# EAGLE design Environment-ArduinoNano33-V10.1-Top (EAGLE 7.4.0)
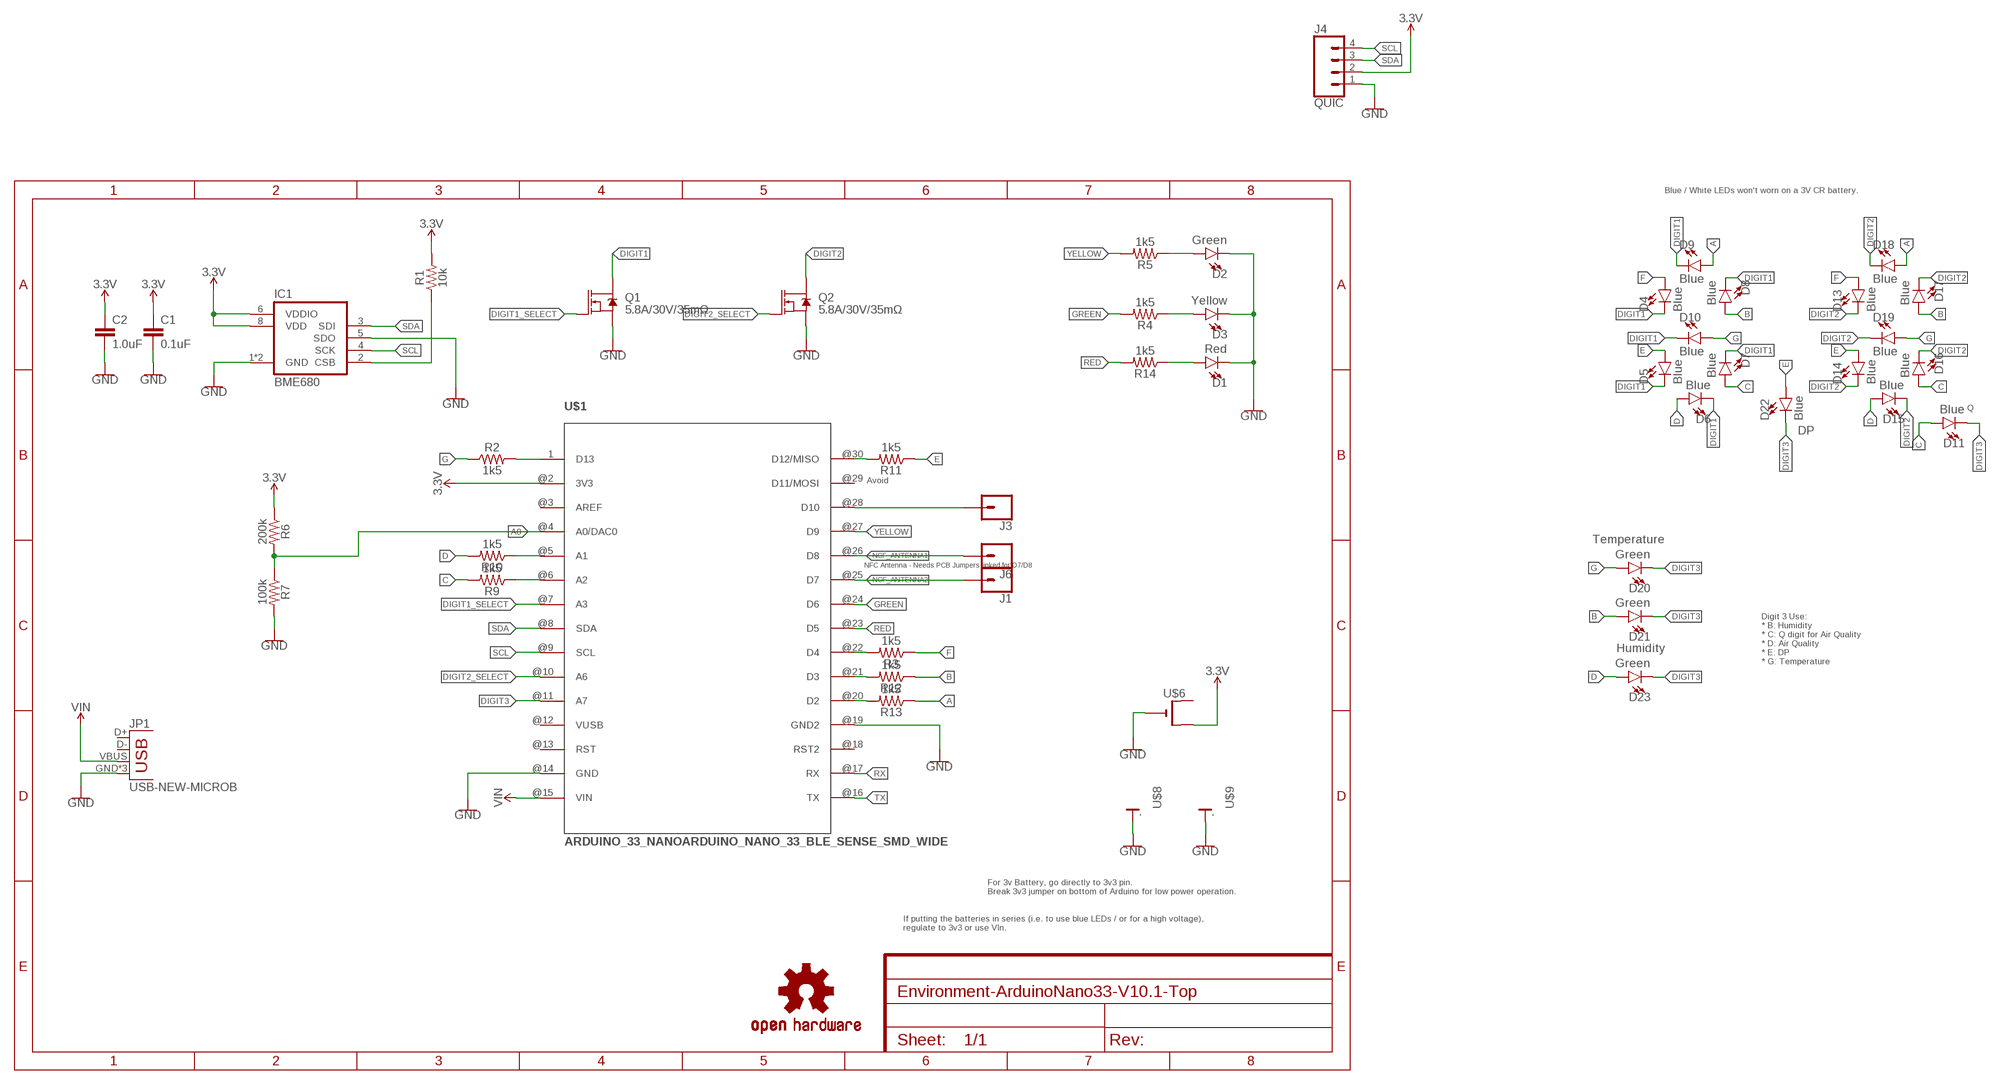
[diagram p0: schematic, sheet 1]

## Parts
C1  0.1uF  0.1UF-0805-25V  [0805]
C2  1.0uF  1.0UF-0805-25V-10%  [0805]
D1  Red  LED1206  [LED-1206]
D2  Green  LED1206  [LED-1206]
D3  Yellow  LED1206  [LED-1206]
D4  Blue  LED1206  [LED-1206]
D5  Blue  LED1206  [LED-1206]
D6  Blue  LED1206  [LED-1206]
D7  Blue  LED1206  [LED-1206]
D8  Blue  LED1206  [LED-1206]
D9  Blue  LED1206  [LED-1206]
D10  Blue  LED1206  [LED-1206]
D11  Blue  LED1206  [LED-1206]
D13  Blue  LED1206  [LED-1206]
D14  Blue  LED1206  [LED-1206]
D15  Blue  LED1206  [LED-1206]
D16  Blue  LED1206  [LED-1206]
D17  Blue  LED1206  [LED-1206]
D18  Blue  LED1206  [LED-1206]
D19  Blue  LED1206  [LED-1206]
D20  Green  LED1206  [LED-1206]
D21  Green  LED1206  [LED-1206]
D22  Blue  LED1206  [LED-1206]
D23  Green  LED1206  [LED-1206]
IC1  BME680  [BME680]
J1  CONN_01  [1X01]
J3  CONN_01  [1X01]
J4  QUIC  CONN_04SMD2  [JST04_1MM_RA]
J6  CONN_01  [1X01]
JP1  USB-NEW-MICROB  [USB-MICROB]
LOGO1  OSHW-LOGOM  [OSHW-LOGO-M]
Q1  5.8A/30V/35mΩ  MOSFET-NCH-AO3404A  [SOT23-3]
Q2  5.8A/30V/35mΩ  MOSFET-NCH-AO3404A  [SOT23-3]
R1  10k  RESISTOR0805  [0805]
R2  1k5  RESISTOR0805  [0805]
R3  1k5  RESISTOR0805  [0805]
R4  1k5  RESISTOR0805  [0805]
R5  1k5  RESISTOR0805  [0805]
R6  200k  RESISTOR0805  [0805]
R7  100k  RESISTOR0805  [0805]
R9  1k5  RESISTOR0805  [0805]
R10  1k5  RESISTOR0805  [0805]
R11  1k5  RESISTOR0805  [0805]
R12  1k5  RESISTOR0805  [0805]
R13  1k5  RESISTOR0805  [0805]
R14  1k5  RESISTOR0805  [0805]
U$1  ARDUINO_33_NANOARDUINO_NANO_33_BLE_SENSE_SMD_WIDE  [ARDUINO_NANO_33_SMD_WIDER_PADS]
U$6  CR2032SMT  [CR2032-SMD]
U$8  CR2032-SPLIT-PCBCR2032-NEGATIVE  [CR2032-SMD-NEGATIVE-TERMINAL]
U$9  CR2032-SPLIT-PCBCR2032-NEGATIVE  [CR2032-SMD-NEGATIVE-TERMINAL]

## Nets
3.3V: C1.1 C2.1 IC1.6(VDDIO) IC1.8(VDD) J4.2 R1.2 R6.1 U$1.@2(3V3) U$6.+$2(+1)
A: D9.A D18.A R13.1
A0: R6.2 R7.1 U$1.@4(A0/DAC0)
B: D8.A D17.A D21.A R12.1
C: D7.A D11.A D16.A R9.2
D: D6.A D15.A D23.A R10.2
DIGIT1: D4.C D5.C D6.C D7.C D8.C D9.C D10.C Q1.3(D)
DIGIT1_SELECT: Q1.1(G) U$1.@7(A3)
DIGIT2: D13.C D14.C D15.C D16.C D17.C D18.C D19.C Q2.3(D)
DIGIT2_SELECT: Q2.1(G) U$1.@10(A6)
DIGIT3: D11.C D20.C D21.C D22.C D23.C U$1.@11(A7)
E: D5.A D14.A D22.A R11.1
F: D4.A D13.A R3.1
G: D10.A D19.A D20.A R2.1
GND: C1.2 C2.2 D1.C D2.C D3.C IC1.1(GND) IC1.5(SDO) IC1.7(GND) J4.1 JP1.GND JP1.MT1(GND) JP1.MT2(GND) Q1.2(S) Q2.2(S) R7.2 U$1.@14(GND) U$1.@19(GND2) U$6.- U$8.- U$9.-
GREEN: R4.2 U$1.@24(D6)
N$2: IC1.2(CSB) R1.1
N$4: D1.A R14.1
N$7: R9.1 U$1.@6(A2)
N$8: R2.2 U$1.1(D13)
N$9: R11.2 U$1.@30(D12/MISO)
N$10: R12.2 U$1.@21(D3)
N$11: R10.1 U$1.@5(A1)
N$12: R13.2 U$1.@20(D2)
N$13: R3.2 U$1.@22(D4)
N$14: D3.A R4.1
N$16: D2.A R5.1
N$43: J3.1 U$1.@28(D10)
NCF_ANTENNA1: J6.1 U$1.@26(D8)
NCF_ANTENNA2: J1.1 U$1.@25(D7)
RED: R14.2 U$1.@23(D5)
RX: U$1.@17(RX)
SCL: IC1.4(SCK) J4.4 U$1.@9(SCL)
SDA: IC1.3(SDI) J4.3 U$1.@8(SDA)
TX: U$1.@16(TX)
VIN: JP1.VBUS U$1.@15(VIN)
YELLOW: R5.2 U$1.@27(D9)
Unconnected: JP1.D+ JP1.D- U$1.@3(AREF) U$1.@13(RST) U$1.@18(RST2) U$1.@29(D11/MOSI) U$6.+$1(+)

## Notes on the sheet
- Blue / White LEDs won't worn on a 3V CR battery.
- Q
- DP
- Avoid
- Temperature
- NFC Antenna - Needs PCB Jumpers linked for D7/D8
- Humidity
- Digit 3 Use:
  * B: Humidity
  * C: Q digit for Air Quality
  * D: Air Quality
  * E: DP
  * G: Temperature
- For 3v Battery, go directly to 3v3 pin.
  Break 3v3 jumper on bottom of Arduino for low power operation.
- If putting the batteries in series (i.e. to use blue LEDs / or for a high voltage), 
  regulate to 3v3 or use VIn.

## Power pins joined to a net without a drawn wire
VUSB: U$1.@12(VUSB)

## Library data of the parts
C1 = ThingySticks:0.1UF: 0.1µF ceramic capacitors A capacitor is a passive two-terminal electrical component used to store electrical energy temporarily in an electric field.
C2 = ThingySticks:1.0UF: 1µF ceramic capacitors A capacitor is a passive two-terminal electrical component used to store electrical energy temporarily in an electric field.
D1-D11 D13-D23 = ThingySticks:LED: LED (Generic) Standard schematic elements and footprints for 5mm, 3mm, 1206, and 0603 sized LEDs. Generic LEDs with no color specified.
IC1 = ThingySticks:BME680: BME680 integrates for the first time individual high linearity and high accuracy sensors for gas, pressure, humidity and temperature. The library has been designed by Richard Magdycz <https://www.facebook.com/groups/eaglecadsoftUK> Original version had pins in incorrect places (BME680 uses untypical clockwise direction). Updated 17 Feb 2018 S.Harrison ThingySticks.com
J1 J3 J6 = SparkFun-Connectors:CONN_01: Single connection point. Often used as Generic Header-pin footprint for 0.1 inch spaced/style header connections On any of the 0.1 inch spaced packages, you can populate with these: Break Away Headers - Straight <https://www.sparkfun.com/products/116> (PRT-00116) Break Away Male Headers - Right Angle <https://www.sparkfun.com/products/553> (PRT-00553) Female Headers <https://www.sparkfun.com/products/115> (PRT-00115) Break Away Headers - Machine Pin <https://www.sparkfun.com/products/117> (PRT-00117) Break Away Female Headers - Swiss Machine Pin <https://www.sparkfun.com/products/743> (PRT-00743) This device is also useful as a general connection point to wire up your design to another part of your project. Our various solder wires solder well into these plated through hole pads. Hook-Up Wire - Assortment (Stranded, 22 AWG) <https://www.sparkfun.com/products/11375> (PRT-11375) Hook-Up Wire - Assortment (Solid Core, 22 AWG) <https://www.sparkfun.com/products/11367> (PRT-11367) View the entire wire category on our website here <https://www.sparkfun.com/categories/141> Special notes: SMTSO-256-ET is a "flush mount" nut for a 4-40 screw. We mostly use this on specialty testbeds; it is a nice way to connect hardware to your PCB at an adjustable hieght. Also note, the SNAP packages are for using a snappable style connector. We sell a baggie of snaps and they are also used on two LilyPad designs: Snap Assortment - 30 pack (male and female) <https://www.sparkfun.com/products/11347> (DEV-11347) LilyPad Arduino SimpleSnap <https://www.sparkfun.com/products/10941> (DEV-10941) LilyPad SimpleSnap Protoboard <https://www.sparkfun.com/products/10940> (DEV-10940)
J4 = SparkFun-Connectors-2020-01-17:CONN_04: Multi connection point. Often used as Generic Header-pin footprint for 0.1 inch spaced/style header connections On any of the 0.1 inch spaced packages, you can populate with these: Break Away Headers - Straight <https://www.sparkfun.com/products/116> (PRT-00116) Break Away Male Headers - Right Angle <https://www.sparkfun.com/products/553> (PRT-00553) Female Headers <https://www.sparkfun.com/products/115> (PRT-00115) Break Away Headers - Machine Pin <https://www.sparkfun.com/products/117> (PRT-00117) Break Away Female Headers - Swiss Machine Pin <https://www.sparkfun.com/products/743> (PRT-00743) For SCREWTERMINALS and SPRING TERMINALS visit here: Screw Terimnals on SparkFun.com <https://www.sparkfun.com/search/results?term=Screw+Terminals> (5mm/3.5mm/2.54mm spacing) This device is also useful as a general connection point to wire up your design to another part of your project. Our various solder wires solder well into these plated through hole pads. Hook-Up Wire - Assortment (Stranded, 22 AWG) <https://www.sparkfun.com/products/11375> (PRT-11375) Hook-Up Wire - Assortment (Solid Core, 22 AWG) <https://www.sparkfun.com/products/11367> (PRT-11367) View the entire wire category on our website here <https://www.sparkfun.com/categories/141> Special notes: Molex polarized connector foot print use with SKU : PRT-08231 with associated crimp pins and housings. 1MM SMD Version SKU: PRT-10208; PROD_ID: CONN-10310; SF_ID: PRT-10208
JP1 = Tinamous:USB-NEW: USB Connectors USB-B-PTH is fully proven SKU : PRT-00139/CONN-08278 USB-miniB is fully proven SKU : PRT-00587 USB-A-PCB is untested. USB-A-H is throughly reviewed, but untested. Spark Fun Electronics SKU : PRT-00437 USB-B-SMT is throughly reviewed, but untested. Needs silkscreen touching up. USB-A-S has not been used/tested USB-MB-H has not been used/tested USB-MICROB has been used. CONN-09505; PROD_ID: CONN-09505
LOGO1 = SparkFun-Aesthetics:OSHW-LOGO: Open-Source Hardware (OSHW) Logo This logo indicates the piece of hardware it is found on incorporates a OSHW license and/or adheres to the definition of open source hardware found here: http://freedomdefined.org/OSHW
Q1 Q2 = SparkFun-DiscreteSemi:MOSFET-NCH: N-channel MOSFETs Voltage controlled devices that allow control of high current outputs. SparkFun Products: SparkFun OpenScale <https://www.sparkfun.com/products/13261> SparkFun Digital Sandbox <https://www.sparkfun.com/products/12651> SparkFun Monster Moto Shield <https://www.sparkfun.com/products/10182> SparkFun MOSFET Power Controller <https://www.sparkfun.com/products/11214>; PROD_ID: TRANS-12988
R1-R7 R9-R14 = SparkFun-Resistors:RESISTOR: Generic Resistor Package
U$1 = ThingySticks:ARDUINO_33_NANO: https://store.arduino.cc/nano-33-iot
U$6 = ThingySticks:CR2032
U$8 U$9 = ThingySticks:CR2032-SPLIT-PCB

## Board
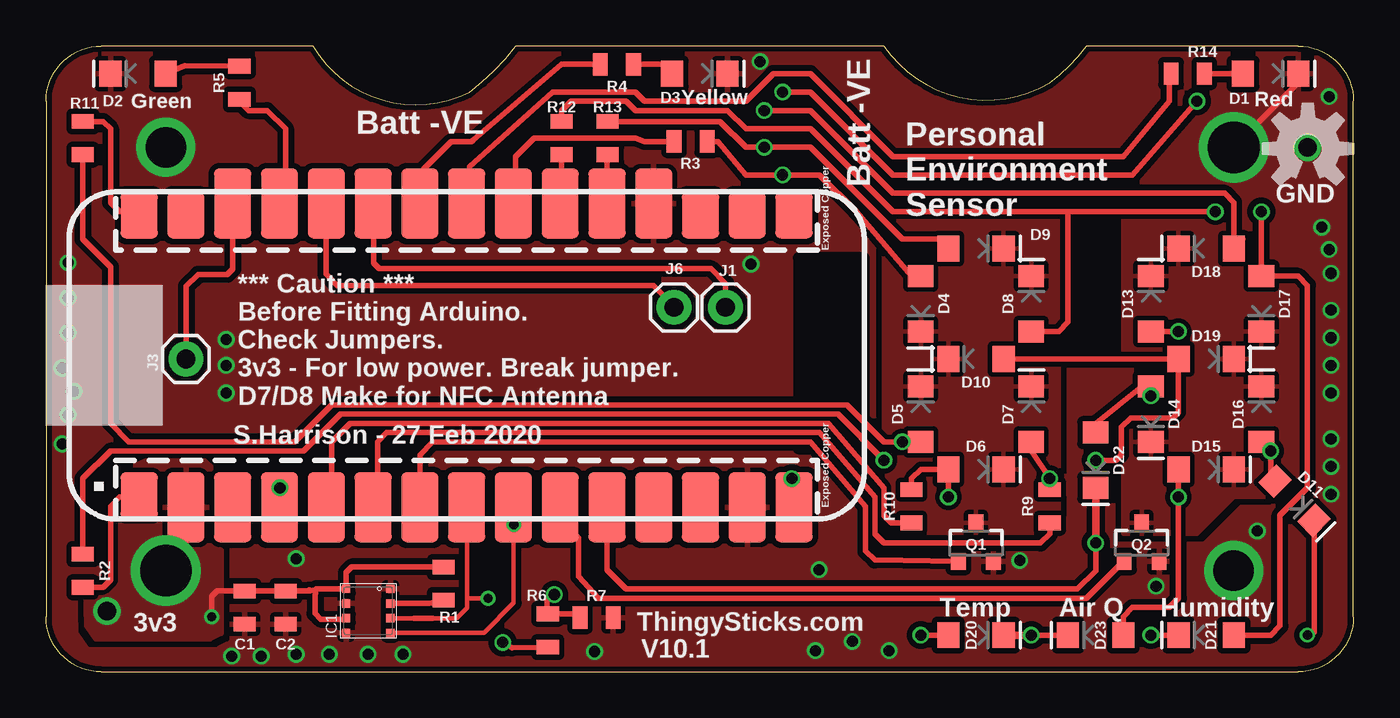
[diagram p1: board, top side]
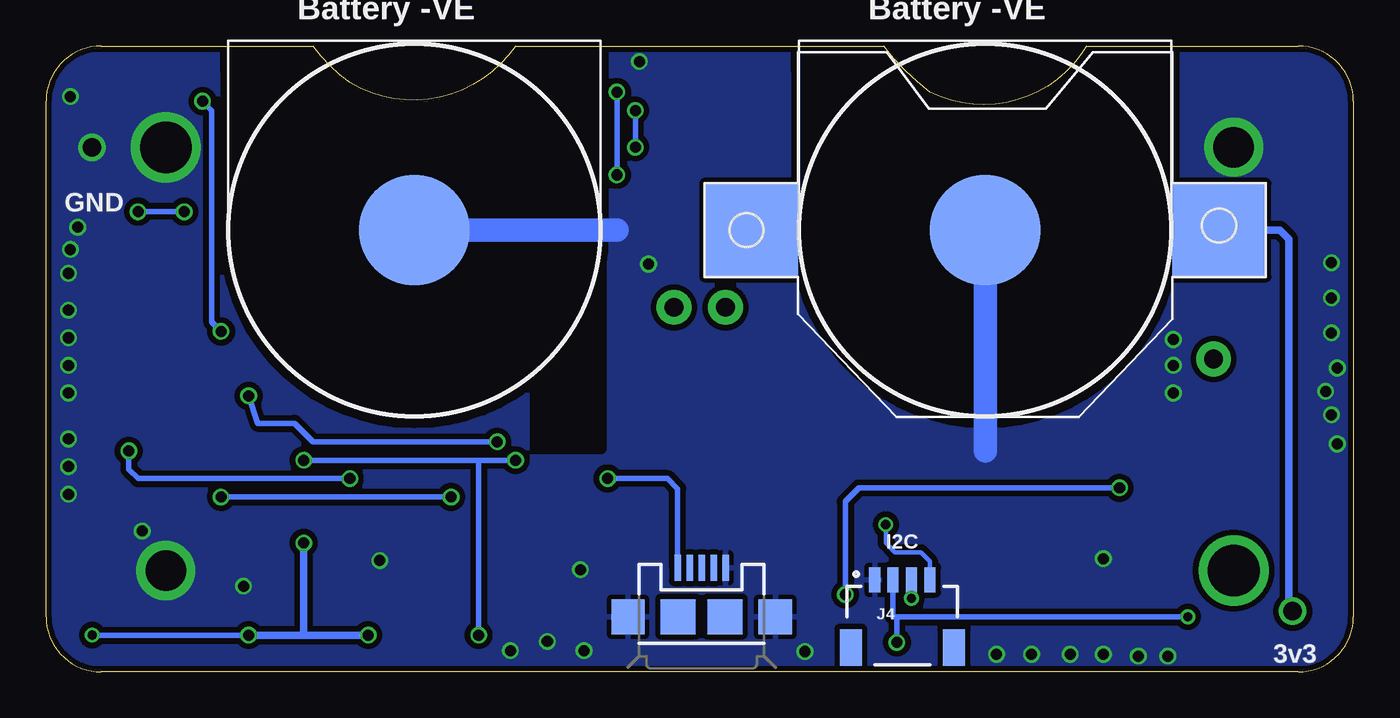
[diagram p2: board, bottom side, seen from below]

Size 71 x 34 mm. Coordinates in mm from the lower left corner, seen from the top.
Outline: 3,0 68,0 arc90 71,3 71,31 arc90 68,34 56.5,34 arc-16 54.5,32 arc-86 45.5,34 25.5,34 arc-16 23,31.5 arc-86 14.5,34 3,34 arc90 0,31 0,3 arc90 3,0
Copper layers (1*16): Top 0.035mm / dielectric 1.5mm / Bottom 0.035mm
Design rules "dirt_cheap_dirty_boards.v1.1": minimum track width 6mil, minimum drill 12mil, track to track 6mil, track to pad 6mil, pad to pad 6mil, via to via 6mil, smd to smd 0mil, copper to edge 10mil, drill to drill 10mil, minimum pad ring 10mil, minimum via ring 6mil, stop-mask expansion 2mil, vias tented up to drill 25mil, thermal gap 10mil
tKeepout: area 4.5,26.5 to 8.5,30.5; area 4.3,3.3 to 8.7,7.7; area 62.3,3.3 to 66.7,7.7; area 62.3,26.3 to 66.7,30.7
bKeepout: area 62.5,26.5 to 66.5,30.5; area 62.5,3.5 to 66.5,7.5; area 4.3,26.3 to 8.7,30.7; area 4.5,3.5 to 8.5,7.5; area 0,0 to 71,34
bRestrict: area 10,14 to 30,34; area 41,14 to 61,34

### Footprints (pad centres in the part's own frame; a part is rotated, then mirrored left to right if it is on the bottom)
0805 = smd 0.8 x 1.2: 1 -0.9,0; 2 0.9,0
LED-1206 = smd 1.2 x 1.4: A -1.5,0; C 1.5,0
BME680 = smd 0.45 x 0.45: 1 1.2,-1.2; 2 0.4,-1.2; 3 -0.4,-1.2; 4 -1.2,-1.2; 5 -1.2,1.2; 6 -0.4,1.2; 7 0.4,1.2; 8 1.2,1.2
1X01 = drill 1.016 pad 1.88: 1 0,0
JST04_1MM_RA = smd 0.6 x 1.35: 1 -1.5,0; 2 -0.5,0; 3 0.5,0; 4 1.5,0 | smd 1.2 x 2: NC1 2.8,-3.675; NC2 -2.8,-3.675
USB-MICROB = smd 0.35 x 1.4: D+ 0,2.65; D- -0.65,2.65; GND 1.3,2.65; ID 0.65,2.65; VBUS -1.3,2.65 | smd 1.8 x 1.9: MT1 -4,0; MT2 4,0 | smd 1.9 x 1.9: P$1 -1.27,0; P$2 1.27,0
SOT23-3 = smd 0.8 x 0.9: 1 -0.95,-1; 2 0.95,-1; 3 0,1.1
ARDUINO_NANO_33_SMD_WIDER_PADS = smd 2.54 x 2.032: 1 1.27,-3.81; @16 16.51,-39.37; @17 16.51,-36.83; @18 16.51,-34.29; @29 16.51,-6.35; @30 16.51,-3.81 | smd 3.81 x 2.032: @2 0.635,-6.35; @3 0.635,-8.89; @4 0.635,-11.43; @5 0.635,-13.97; @6 0.635,-16.51; @7 0.635,-19.05; @8 0.635,-21.59; @9 0.635,-24.13; @10 0.635,-26.67; @11 0.635,-29.21; @12 0.635,-31.75; @13 0.635,-34.29; @14 0.635,-36.83; @15 0.635,-39.37; @19 17.145,-31.75; @20 17.145,-29.21; @21 17.145,-26.67; @22 17.145,-24.13; @23 17.145,-21.59; @24 17.145,-19.05; @25 17.145,-16.51; @26 17.145,-13.97; @27 17.145,-11.43; @28 17.145,-8.89
CR2032-SMD = smd 5.08 x 5.08: +$1 -12.7,0; +$2 12.7,0 | smd 4.064 x 4.064: - 0,0
CR2032-SMD-NEGATIVE-TERMINAL = smd 6 x 6: - 0,0

### Placement (x,y rotation side)
C1  10.79,3.49 270 top
C2  13.02,3.49 270 top
D1  66.5,32.5 0 top
D2  5,32.5 180 top
D3  35.5,32.5 0 top
D4  47.5,20 270 top
D5  47.5,14 90 top
D6  50.5,11 0 top
D7  53.5,14 90 top
D8  53.5,20 90 top
D9  50.5,23 0 top
D10  50.5,17 180 top
D11  67.8,9.3 315 top
D13  60,20 90 top
D14  60,14 270 top
D15  63,11 0 top
D16  66,14 90 top
D17  66,20 270 top
D18  63,23 180 top
D19  63,17 0 top
D20  50.5,2 0 top
D21  63,2 180 top
D22  57,11.5 270 top
D23  57,2 180 top
IC1  17.5,3.32 90 top
J1  36.9,19.8 270 top
J3  7.6,17 0 top
J4  24.5,5 0 bottom
J6  34.1,19.8 270 top
JP1  35.4,3 0 bottom
LOGO1  68.53,28.42 0 top
Q1  50.5,7 0 top
Q2  59.5,7 0 top
R1  21.59,4.8 90 top
R2  2,5.5 270 top
R3  35,28.82 180 top
R4  31,33 180 top
R5  10.5,32 270 top
R6  27.25,2.25 90 top
R7  29.9,2.95 0 top
R9  54.5,9 90 top
R10  47,9 90 top
R11  2,29 90 top
R12  28,29 270 top
R13  30.5,29 270 top
R14  62,32.5 180 top
U$1  1.25,8.3 90 top
U$6  20,24 0 bottom
U$8  20,24 0 bottom
U$9  51,24 0 bottom

### Tracks (layer width: path | path; a pad name or v marks a point on that pad's centre or on a via)
3.3V  (via drill 0.5, 0.6, 1, 2.8)
  Top 0.305: 14.85,4.52 14.68,4.52 14.61,4.13 14.61,3.17 14.92,2.86 16.24,2.86 IC1.6 | 14.34,4.39 14.29,4.45 | 7.94,7.94 7.62,8.26 7.62,9.55 U$1.@2 | C2.1 C1.1 9.29,4.39 9,4.1 v9,3 | C2.1 14.34,4.39 | 14.34,4.39 14.85,4.52 | 14.85,4.52 IC1.8 16.3,5.4 16.6,5.7 R1.2 | 13,4.41 C2.1 | R6.1 26.95,1.35 25.3,1.3 v24.8,1.6
  Bottom 0.305: J4.2 25,3 24.8,3 | 24.8,3 v9,3 | v24.8,1.6 24.8,3
  Bottom 0.406: U$6.+$2 4,24 3.5,23.5 3.5,3.5 v3.3,3.3
  other vias: 6.5,5.5
  pour Top (isolate 0.254, rank 2): 5.5,11.5 8.6,11.5 9.1,11 8.9,7.3 9.2,6.8 9.5,6.6 9.5,2.1 8.9,1.8 2.7,1.8 2.2,2.5 2,10
A  (via drill 0.6)
  Top 0.305: D18.A 65,23.5 64.5,23.5 64.5,25.5 64,26 46,26 41.5,30.5 v39,30.5 | D9.A 48.5,23.5 46.5,23.5 41.5,28.5 v39,28.5 38,28.5 36.6,29.9 R13.1
  Bottom 0.305: v39,28.5 v39,30.5
A0  (via drill 0.6)
  Top 0.254: 12.7,9.6 12.7,10.1 U$1.@4
  Top 0.305: 12.7,9.6 v12.7,10 | R7.1 28.8,3.15 R6.2 27.2,3.2 27.2,3.9 27.3,4 v27.6,4.2
  Bottom 0.305: v12.7,10 26.85,10 27.6,9.25 v27.6,4.2
B  (via drill 0.6)
  Top 0.305: v63.5,25 55.5,25 | 55.5,25 46,25 41.5,29.5 38,29.5 37,30.5 32,30.5 31.5,31 28.5,31 28,30.5 R12.1 | v66,25 D17.A 68,21.5 68.5,21 68.5,10 67,8.5 67,2.5 66.5,2 D21.A | D8.A 55,18.5 55.5,19 55.5,25
  Bottom 0.305: v63.5,25 v66,25
C  (via drill 0.6)
  Top 0.305: D16.A v66.5,12 66.5,10.6 D11.A | D7.A 53.5,12 v54.5,10.5 R9.2
  Bottom 0.305: v66.5,12 66.5,11 66,10.5 v54.5,10.5
D  (via drill 0.6)
  Top 0.305: D15.A v61.5,9.5 61.5,4 61,3.5 59,3.5 58.5,3 D23.A | v49,9.5 D6.A 47.5,11 47,10.5 R10.2
  Bottom 0.305: v61.5,9.5 v49,9.5
DIGIT1
  pour Top (isolate 0.254, rank 2): 45.5,24.5 55,24.5 55,7.5 45.5,7.5
DIGIT1_SELECT
  Top 0.305: Q1.1 45,6.08 44.5,6.58 44.5,9 41.5,12.5 21,12.5 20.3,11.8 U$1.@7
DIGIT2
  pour Top (isolate 0.254, rank 2): 58.5,25 68,25 68,10.5 67,9.5 64.5,9.5 62.5,7.5 58.5,7.5
DIGIT2_SELECT
  Top 0.305: Q2.1 58.35,5.85 56.5,4 30,4 28.92,5.18 28.92,7.28 27.9,8.3 U$1.@10
DIGIT3  (via drill 0.5, 0.6)
  Top 0.305: v57,7 57,5.5 56,4.5 31.5,4.5 30.46,5.54 30.5,8.8 30.46,8.96 U$1.@11 | 61,2 v60,2 | D23.C v53.5,2 | D11.C 68.86,2.14 v68.5,2
  Top 0.406: D22.C v57,7 | D21.C 61,2 | D20.C v53.5,2
  Bottom 0.305: v68.5,2 v60,2
  Bottom 0.406: v57,7 57,2 | 57,2 v60,2 | v53.5,2 57,2
E  (via drill 0.6)
  Top 0.305: v60,15 D14.A 59.5,15.5 57,13.5 D22.A | R11.1 2,23.5 3.5,22 3.5,13.5 4.5,12.5 13.5,12.5 15.5,14.5 43.5,14.5 45.5,12.5 v46.5,12.5 D5.A
  Bottom 0.305: v60,15 59.5,13.5 57.5,13.5 56.5,12.5 v46.5,12.5
F  (via drill 0.6)
  Top 0.305: v62.5,31 59,27 46,27 41.5,31.5 v40,31.5 | D4.A 47,21.5 44,25 42,27 v40,27 38,27 36.5,28.82 R3.1 | D13.A v61.5,18.5
  Bottom 0.305: v40,31.5 v40,27 | v62.5,31 62,30.5 62,19 v61.5,18.5
G  (via drill 0.6)
  Top 0.305: D10.A D19.A 61.5,14.1 61.2,13.8 58.9,13.8 58.4,13.3 58.4,11.8 58.1,11.5 v57,11.5 | v45.5,11.5 43,14 16,14 14,12 3.5,12 2,10.5 R2.1 | v47.5,2 D20.A
  Bottom 0.305: v57,11.5 47.5,11.5 | v45.5,11.5 47.5,11.5 | 47.5,11.5 v47.5,2
GND  (via drill 0.6, 1, 2.2, 2.8)
  Top 0.305: D1.C 68,32 v64.5,28.5
  Bottom 1.27: U$6.- 20,12 | U$9.- 40,24
  other vias: 60.28,4.65 52.88,6.05 65.78,7.65 69.28,24.15 38.78,33.15 9.78,18.05 41.78,1.15 29.79,1.1 68.5,28.5 69.78,21.65 69.78,19.65 69.78,15.15 69.78,12.65 69.78,11.15 69.78,9.65 38.28,22.15 45.78,1.15 43.78,1.65 17.48,0.95 9.78,16.65 6.5,28.5 64.5,5.5 41.98,5.55 9.78,15.15 13.58,6.15 69.78,18.15 69.78,16.65 69.68,22.95 69.68,31.25 19.38,0.95 15.38,0.95 13.58,0.95 11.68,0.85 10.08,0.85 0.88,12.38 1.2,13.97 1.51,15.24 0.88,16.51 1.2,18.41 1.2,20.32 1.2,22.23
  pour Bottom (isolate 0.305, rank 6): 0,33.97 71.12,33.97 71.12,0 0,0
  pour Top (isolate 0.305, rank 6): 0,33.97 71.12,33.97 71.12,0 0,0
GREEN
  Top 0.305: U$1.@24 20.5,25.2 20.5,27.3 22,28.8 23.1,28.8 23.2,28.9 28,33 R4.2
N$2
  Top 0.305: IC1.2 20.81,3.72 R1.1
N$4
  Top 0.305: R14.1 D1.A
N$7
  Top 0.305: R9.1 54.5,7.5 54,7 45.5,7 45,7.5 45,9.5 42,13 18.5,13 18,12.5 18,9.81 U$1.@6
N$8
  Top 0.305: R2.2 3.1,4.6 3.5,5 3.5,9 4,9.5 4.99,9.5 U$1.1
N$9
  Top 0.305: R11.2 3.1,29.9 3.5,29.5 3.5,25.5 4,25 4.88,25 U$1.@30
N$10
  Top 0.305: R12.2 28,24.89 U$1.@21
N$11
  Top 0.305: R10.1 45.9,8.1 45.5,8.5 45.5,10 42.5,13.5 16.5,13.5 15.5,12.5 15.5,9.86 U$1.@5
N$12
  Top 0.305: R13.2 30.46,27.56 U$1.@20
N$13
  Top 0.305: U$1.@22 25.5,25 25.5,28 26.5,29 32,29 32.5,28.82 R3.2
N$14
  Top 0.305: R4.1 33.95,33 D3.A
N$16
  Top 0.305: D2.A 7.53,32.93 R5.1
N$43
  Top 0.305: U$1.@28 10.14,21.89 9.84,21.59 8.26,21.59 7.62,20.95 7.62,17.02 J3.1
NCF_ANTENNA1
  Top 0.305: J6.1 34.1,19.9 33,21 15.8,21 15.2,21.6 15.2,24.8 U$1.@26
NCF_ANTENNA2
  Top 0.305: J1.1 36.9,21.1 36.1,21.9 18.1,21.9 17.8,22.2 17.8,24.77 U$1.@25
RED
  Top 0.305: U$1.@23 23,27.45 27.5,31.5 32,31.5 32.5,31 38,31 39.5,32.5 41.5,32.5 46,28 58.5,28 61,31 61,32.4 R14.2
SCL  (via drill 0.5)
  Top 0.254: IC1.4 23.78,2.12 25.4,3.74 v25.4,8 | 25.4,9 25.4,9.55 U$1.@9
  Top 0.305: 25.4,9.6 U$1.@9 | v25.4,8 25.4,9
  Bottom 0.254: J4.4 23,6 23.5,6.5 24.9,6.5 25.4,7 v25.4,8
SDA  (via drill 0.5)
  Top 0.254: IC1.3 20,2.92 | 21,2.92 22.29,2.92 22.86,3.49 22.86,4 | 22.86,4 22.86,8 | 22.86,9 22.86,9.55 U$1.@8 | v24,4 22.86,4
  Top 0.305: 22.86,9.6 U$1.@8 | 20,2.92 21,2.92 | 22.86,8 22.86,9
  Bottom 0.254: J4.3 v24,4
VIN  (via drill 0.6)
  Top 0.61: v40.5,10.5 40.5,9.46 U$1.@15
  Bottom 0.305: JP1.VBUS 36.7,9.95 37.25,10.5 v40.5,10.5
YELLOW
  Top 0.305: R5.2 10.4,31.1 11,30.5 12,30.5 13,29.5 13,25.09 U$1.@27

### Text on the board
tNames: Batt -VE | Green | Yellow | Red | Batt -VE | GND | Personal / Environment / Sensor | *** Caution *** / Before Fitting Arduino. / Check Jumpers. / 3v3 - For low power. Break jumper. / D7/D8 Make for NFC Antenna | S.Harrison - 27 Feb 2020 | 3v3 | Temp | Air Q | Humidity | ThingySticks.com | V10.1
bNames: GND | I2C | 3v3
Document: For Enclosure: / Hammon - 1551V2WH - / Plastic Enclosure, Small, ABS, 80 mm, 40 mm, 20 mm, IP30 / / Farnell: 2985869 | Top PCB has pads on solder side / for battery -VE connection
Reference: Top PCB
tDocu: NFC Pads